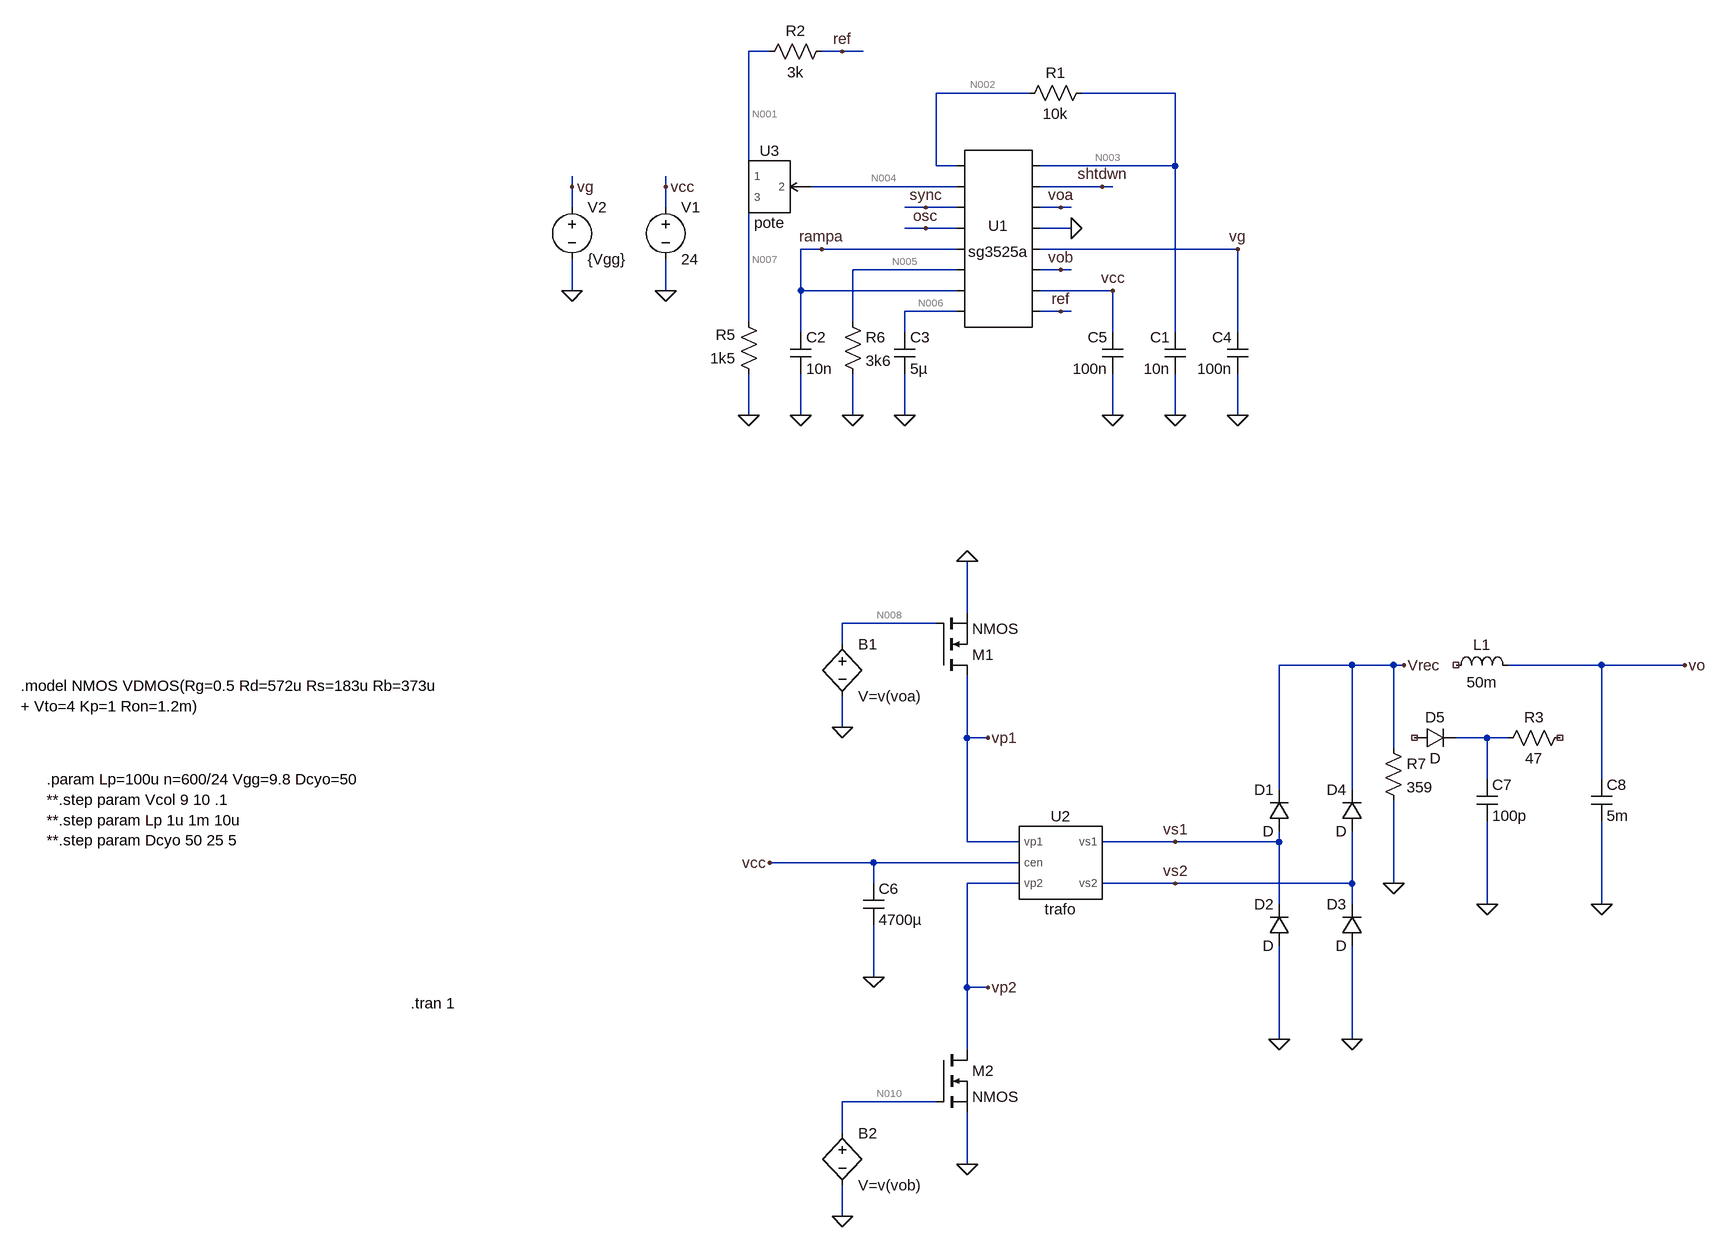
[diagram p0: schematic tests.asc]
tests.asc, the LTspice schematic file:
Version 4
SHEET 1 2604 1608
WIRE -176 -256 -208 -256
WIRE -64 -256 -96 -256
WIRE -32 -256 -64 -256
WIRE 224 -192 80 -192
WIRE 448 -192 304 -192
WIRE 80 -80 80 -192
WIRE 112 -80 80 -80
WIRE 448 -80 448 -192
WIRE 448 -80 240 -80
WIRE -208 -64 -208 -256
WIRE -480 -48 -480 -64
WIRE -336 -48 -336 -64
WIRE 112 -48 -112 -48
WIRE 336 -48 240 -48
WIRE 352 -48 336 -48
WIRE -480 -16 -480 -48
WIRE -336 -16 -336 -48
WIRE 64 -16 32 -16
WIRE 112 -16 64 -16
WIRE 272 -16 240 -16
WIRE 288 -16 272 -16
WIRE 64 16 32 16
WIRE 112 16 64 16
WIRE 288 16 240 16
WIRE -96 48 -128 48
WIRE 112 48 -96 48
WIRE 544 48 240 48
WIRE 112 80 -48 80
WIRE 272 80 240 80
WIRE 288 80 272 80
WIRE -480 112 -480 64
WIRE -336 112 -336 64
WIRE -128 112 -128 48
WIRE 112 112 -128 112
WIRE 352 112 240 112
WIRE 112 144 32 144
WIRE 272 144 240 144
WIRE 288 144 272 144
WIRE -208 160 -208 -32
WIRE -48 160 -48 80
WIRE -128 176 -128 112
WIRE 32 176 32 144
WIRE 352 176 352 112
WIRE 448 176 448 -80
WIRE 544 176 544 48
WIRE -208 304 -208 240
WIRE -128 304 -128 240
WIRE -48 304 -48 240
WIRE 32 304 32 240
WIRE 352 304 352 240
WIRE 448 304 448 240
WIRE 544 304 544 240
WIRE 128 608 128 528
WIRE 80 624 -64 624
WIRE -64 656 -64 624
WIRE 720 688 608 688
WIRE 784 688 720 688
WIRE 800 688 784 688
WIRE 1104 688 960 688
WIRE 1232 688 1104 688
WIRE -64 784 -64 736
WIRE 128 800 128 704
WIRE 160 800 128 800
WIRE 928 800 880 800
WIRE 960 800 928 800
WIRE 784 816 784 688
WIRE 928 864 928 800
WIRE 1104 864 1104 688
WIRE 608 880 608 688
WIRE 720 880 720 688
WIRE 128 960 128 800
WIRE 208 960 128 960
WIRE 448 960 336 960
WIRE 608 960 608 944
WIRE 608 960 448 960
WIRE -16 992 -176 992
WIRE 208 992 -16 992
WIRE -16 1024 -16 992
WIRE 208 1024 128 1024
WIRE 448 1024 336 1024
WIRE 720 1024 720 944
WIRE 720 1024 448 1024
WIRE 784 1024 784 896
WIRE 608 1056 608 960
WIRE 720 1056 720 1024
WIRE 928 1056 928 928
WIRE 1104 1056 1104 928
WIRE -16 1168 -16 1088
WIRE 128 1184 128 1024
WIRE 160 1184 128 1184
WIRE 608 1264 608 1120
WIRE 720 1264 720 1120
WIRE 128 1280 128 1184
WIRE 80 1360 -64 1360
WIRE -64 1408 -64 1360
WIRE 128 1456 128 1376
WIRE -64 1536 -64 1488
FLAG 448 304 0
FLAG -208 304 0
FLAG -128 304 0
FLAG -48 304 0
FLAG 32 304 0
FLAG 272 144 ref
FLAG 272 -16 voa
FLAG 272 80 vob
FLAG 288 16 0
FLAG 544 304 0
FLAG 544 48 vg
FLAG 352 304 0
FLAG -64 -256 ref
FLAG 64 -16 sync
FLAG 64 16 osc
FLAG -96 48 rampa
FLAG 352 112 vcc
FLAG -336 112 0
FLAG -336 -48 vcc
FLAG -480 112 0
FLAG -480 -48 vg
FLAG 336 -48 shtdwn
FLAG -16 1168 0
FLAG 608 1264 0
FLAG 720 1264 0
FLAG 1104 1056 0
FLAG 928 1056 0
FLAG -176 992 vcc
FLAG 160 800 vp1
FLAG 448 960 vs1
FLAG 448 1024 vs2
FLAG 128 528 0
FLAG 160 1184 vp2
FLAG 128 1456 0
FLAG -64 784 0
FLAG -64 1536 0
FLAG 800 688 Vrec
FLAG 1232 688 vo
FLAG 784 1024 0
SYMBOL AutoGenerated\\sg3525a 176 32 R0
SYMATTR InstName U1
SYMBOL res 320 -208 R90
WINDOW 0 0 56 VBottom 2
WINDOW 3 32 56 VTop 2
SYMATTR InstName R1
SYMATTR Value 10k
SYMBOL cap 464 240 R180
WINDOW 0 24 56 Left 2
WINDOW 3 24 8 Left 2
SYMATTR InstName C1
SYMATTR Value 10n
SYMBOL res -80 -272 R90
WINDOW 0 0 56 VBottom 2
WINDOW 3 32 56 VTop 2
SYMATTR InstName R2
SYMATTR Value 3k
SYMBOL res -192 256 R180
WINDOW 0 36 76 Left 2
WINDOW 3 36 40 Left 2
SYMATTR InstName R5
SYMATTR Value 1k5
SYMBOL cap -144 176 R0
SYMATTR InstName C2
SYMATTR Value 10n
SYMBOL res -64 144 R0
SYMATTR InstName R6
SYMATTR Value 3k6
SYMBOL cap 16 176 R0
SYMATTR InstName C3
SYMATTR Value 5µ
SYMBOL cap 560 240 R180
WINDOW 0 24 56 Left 2
WINDOW 3 24 8 Left 2
SYMATTR InstName C4
SYMATTR Value 100n
SYMBOL cap 368 240 R180
WINDOW 0 24 56 Left 2
WINDOW 3 24 8 Left 2
SYMATTR InstName C5
SYMATTR Value 100n
SYMBOL voltage -336 -32 R0
WINDOW 123 0 0 Left 0
WINDOW 39 0 0 Left 0
SYMATTR InstName V1
SYMATTR Value 24
SYMBOL voltage -480 -32 R0
WINDOW 123 0 0 Left 0
WINDOW 39 0 0 Left 0
SYMATTR InstName V2
SYMATTR Value {Vgg}
SYMBOL cap -32 1024 R0
SYMATTR InstName C6
SYMATTR Value 4700µ
SYMBOL diode 624 944 R180
WINDOW 0 24 64 Left 2
WINDOW 3 24 0 Left 2
SYMATTR InstName D1
SYMBOL diode 624 1120 R180
WINDOW 0 24 64 Left 2
WINDOW 3 24 0 Left 2
SYMATTR InstName D2
SYMBOL diode 736 1120 R180
WINDOW 0 24 64 Left 2
WINDOW 3 24 0 Left 2
SYMATTR InstName D3
SYMBOL diode 736 944 R180
WINDOW 0 24 64 Left 2
WINDOW 3 24 0 Left 2
SYMATTR InstName D4
SYMBOL diode 816 816 R270
WINDOW 0 32 32 VTop 2
WINDOW 3 0 32 VBottom 2
SYMATTR InstName D5
SYMBOL cap 912 864 R0
SYMATTR InstName C7
SYMATTR Value 100p
SYMBOL cap 1088 864 R0
SYMATTR InstName C8
SYMATTR Value 5m
SYMBOL pote -176 -32 M0
SYMATTR InstName U3
SYMATTR SpiceLine R=10k porc23={Dcyo}
SYMBOL bv -64 640 R0
SYMATTR InstName B1
SYMATTR Value V=v(voa)
SYMBOL bv -64 1392 R0
SYMATTR InstName B2
SYMATTR Value V=v(vob)
SYMBOL nmos 80 704 M180
SYMATTR InstName M1
SYMBOL AutoGenerated\\trafo 272 992 R0
SYMATTR InstName U2
SYMATTR SpiceLine Lp={Lp} n={n} Rmul=100
SYMBOL nmos 80 1280 R0
SYMATTR InstName M2
SYMBOL ind 864 704 R270
WINDOW 0 32 56 VTop 2
WINDOW 3 5 56 VBottom 2
SYMATTR InstName L1
SYMATTR Value 50m
SYMBOL res 1056 784 R90
WINDOW 0 0 56 VBottom 2
WINDOW 3 32 56 VTop 2
SYMATTR InstName R3
SYMATTR Value 47
SYMBOL res 768 800 R0
SYMATTR InstName R7
SYMATTR Value 359
TEXT -1288 864 Left 2 !.param Lp=100u n=600/24 Vgg=9.8 Dcyo=50\n**.step param Vcol 9 10 .1\n**.step param Lp 1u 1m 10u\n**.step param Dcyo 50 25 5
TEXT -1328 720 Left 2 !.model NMOS VDMOS(Rg=0.5 Rd=572u Rs=183u Rb=373u \n+ Vto=4 Kp=1 Ron=1.2m)
TEXT -728 1208 Left 2 !.tran 1

The netlist it stands for:
* tests.asc
* U1: sg3525a (symbol AutoGenerated\sg3525a not available, pins judged from their places): pin1=N002 pin2=N004 pin3=sync pin4=osc pin5=rampa pin6=N005 pin7=rampa pin8=N006 pin9=N003 pin10=shtdwn pin11=voa pin12=0 pin13=vg pin14=vob pin15=vcc pin16=ref
R1 N003 N002 10k
C1 0 N003 10n
R2 ref N001 3k
R5 0 N007 1k5
C2 rampa 0 10n
R6 N005 0 3k6
C3 N006 0 5µ
C4 0 vg 100n
C5 0 vcc 100n
V1 vcc 0 24
V2 vg 0 {Vgg}
C6 vcc 0 4700µ
D1 vs1 Vrec D
D2 0 vs1 D
D3 0 vs2 D
D4 vs2 Vrec D
D5 NC_01 N009 D
C7 N009 0 100p
C8 vo 0 5m
XU3 N001 N004 N007 pote R=10k porc23={Dcyo}  ; pins 1 2 3
B1 N008 0 V=v(voa)
B2 N010 0 V=v(vob)
M1 vp1 N008 0 0 NMOS
XU2 vp1 vp2 vcc vs1 vs2 trafo Lp={Lp} n={n} Rmul=100  ; pins vp1 vp2 cen vs1 vs2
M2 vp2 N010 0 0 NMOS
L1 NC_02 vo 50m
R3 NC_03 N009 47
R7 Vrec 0 359
.model D D
.lib standard.dio
.model NMOS NMOS
.model PMOS PMOS
.lib standard.mos
.param Lp=100u n=600/24 Vgg=9.8 Dcyo=50
**.step param Vcol 9 10 .1
**.step param Lp 1u 1m 10u
**.step param Dcyo 50 25 5
.model NMOS VDMOS(Rg=0.5 Rd=572u Rs=183u Rb=373u
+ Vto=4 Kp=1 Ron=1.2m)
.tran 1
.lib Z:\UNC\2022\powerElectronics\TPT5\sim\pote.cir
.lib Z:\UNC\2022\powerElectronics\TPT5\sim\trafo.cir
.backanno
.end

* Results of the author's LTspice run, read from the files saved beside the schematic
* Operating Point, zero values left out:
*   V(voa) = 8.7 V
*   V(vob) = 303.7 µV
*   V(vg) = 9.8 V
*   V(n004) = 2.289 V
*   V(n003) = 2.31 V
*   V(n002) = 2.287 V
*   V(ref) = 5.125 V
*   V(vcc) = 24 V
*   V(shtdwn) = 450 mV
*   V(n006) = 55.08 V
*   V(rampa) = 5.076 V
*   V(n005) = 3.64 V
*   V(n001) = 4.061 V
*   V(n007) = 528.2 mV
*   V(vs1) = -689.9 mV
*   V(vrec) = 1.379 V
*   V(vs2) = 2.069 V
*   V(n008) = 8.7 V
*   V(n010) = 303.7 µV
*   V(vp1) = 23.89 V
*   V(vp2) = 24 V
*   Id(M2) = 19.05 pA
*   Is(M2) = -19.05 pA
*   Id(M1) = 11.03 A
*   Is(M1) = -11.03 A
*   I(D4) = 3.841 mA
*   I(D3) = -2.079 pA
*   I(D2) = 3.841 mA
*   I(D1) = -2.079 pA
*   I(R7) = 3.841 mA
*   I(R6) = 1.011 mA
*   I(R5) = -352.2 µA
*   I(R2) = 354.4 µA
*   I(R1) = 2.287 µA
*   I(V2) = -155.4 µA
*   I(V1) = -11.06 A